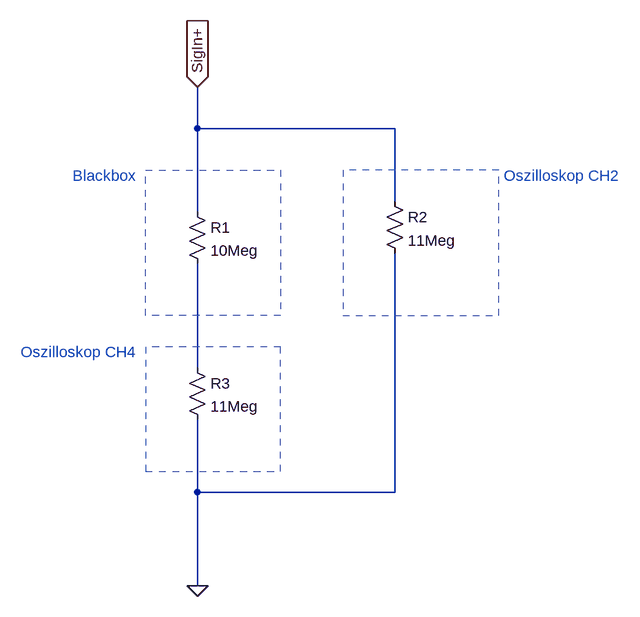
[diagram p0: schematic RMessung10Mohm.asc]
RMessung10Mohm.asc, the LTspice schematic file:
Version 4
SHEET 1 880 932
WIRE 96 144 96 80
WIRE 400 144 96 144
WIRE 400 256 400 144
WIRE 96 272 96 144
WIRE 96 512 96 352
WIRE 96 704 96 592
WIRE 400 704 400 336
WIRE 400 704 96 704
WIRE 96 848 96 704
FLAG 96 80 SigIn+
IOPIN 96 80 In
FLAG 96 848 0
SYMBOL res 80 256 R0
SYMATTR InstName R1
SYMATTR Value 10Meg
SYMBOL res 384 240 R0
SYMATTR InstName R2
SYMATTR Value 11Meg
SYMBOL res 80 496 R0
SYMATTR InstName R3
SYMATTR Value 11Meg
TEXT -96 216 Left 2 ;Blackbox
TEXT -176 488 Left 2 ;Oszilloskop CH4
TEXT 568 216 Left 2 ;Oszilloskop CH2
LINE Normal 224 432 16 432 2
LINE Normal 224 208 224 432 2
LINE Normal 16 208 224 208 2
LINE Normal 16 432 16 208 2
LINE Normal 320 208 320 432 2
LINE Normal 560 208 320 208 2
LINE Normal 560 432 560 208 2
LINE Normal 320 432 560 432 2
LINE Normal 224 480 16 480 2
LINE Normal 224 672 224 480 2
LINE Normal 16 672 224 672 2
LINE Normal 16 480 16 672 2

The netlist it stands for:
* RMessung10Mohm.asc
R1 SigIn+ N001 10Meg
R2 SigIn+ 0 11Meg
R3 N001 0 11Meg
* Blackbox
* Oszilloskop CH4
* Oszilloskop CH2
.backanno
.end